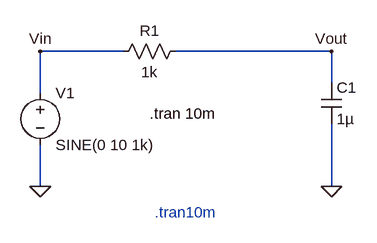
[diagram p0: schematic temel.asc]
temel.asc, the LTspice schematic file:
Version 4
SHEET 1 880 680
WIRE 352 224 224 224
WIRE 672 224 432 224
WIRE 672 272 672 224
WIRE 224 288 224 224
WIRE 224 432 224 368
WIRE 672 432 672 336
FLAG 224 432 0
FLAG 672 432 0
FLAG 224 224 Vin
FLAG 672 224 Vout
SYMBOL res 448 208 R90
WINDOW 0 0 56 VBottom 2
WINDOW 3 32 56 VTop 2
SYMATTR InstName R1
SYMATTR Value 1k
SYMBOL voltage 224 272 R0
SYMATTR InstName V1
SYMATTR Value SINE(0 10 1k)
SYMBOL cap 656 272 R0
SYMATTR InstName C1
SYMATTR Value 1µ
TEXT 400 472 Left 2 ;.tran10m
TEXT 392 320 Left 2 !.tran 10m

The netlist it stands for:
* temel.asc
R1 Vout Vin 1k
V1 Vin 0 SINE(0 10 1k)
C1 Vout 0 1µ
* .tran10m
.tran 10m
.backanno
.end